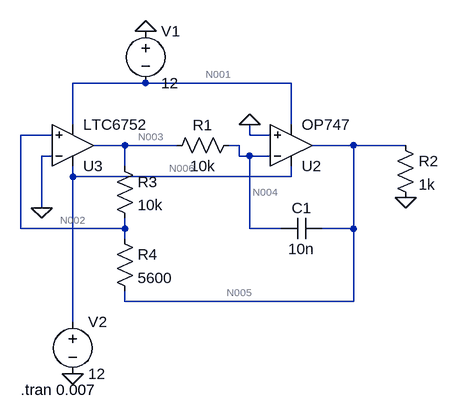
[diagram p0: schematic (labo 3) oscilador onda tirangular ej5tp4.asc]
(labo 3) oscilador onda tirangular ej5tp4.asc, the LTspice schematic file:
Version 4
SHEET 1 1412 680
WIRE 208 64 96 64
WIRE 432 64 208 64
WIRE 96 128 96 64
WIRE 432 128 432 64
WIRE 64 144 16 144
WIRE 368 144 368 128
WIRE 400 144 368 144
WIRE 176 160 128 160
WIRE 256 160 176 160
WIRE 352 160 336 160
WIRE 528 160 464 160
WIRE 608 160 528 160
WIRE 64 176 48 176
WIRE 352 176 352 160
WIRE 368 176 352 176
WIRE 400 176 368 176
WIRE 176 192 176 160
WIRE 96 208 96 192
WIRE 432 208 432 192
WIRE 432 208 96 208
WIRE 48 256 48 176
WIRE 16 288 16 144
WIRE 176 288 176 272
WIRE 176 288 16 288
WIRE 368 288 368 176
WIRE 416 288 368 288
WIRE 528 288 528 160
WIRE 528 288 480 288
WIRE 176 304 176 288
WIRE 176 400 176 384
WIRE 528 400 528 288
WIRE 528 400 176 400
WIRE 96 432 96 208
FLAG 208 -16 0
FLAG 368 128 0
FLAG 608 240 0
FLAG 96 512 0
FLAG 48 256 0
SYMBOL Opamps\\OP747 432 224 M180
SYMATTR InstName U2
SYMBOL voltage 208 -32 R0
SYMATTR InstName V1
SYMATTR Value 12
SYMBOL res 352 144 R90
WINDOW 0 0 56 VBottom 2
WINDOW 3 32 56 VTop 2
SYMATTR InstName R1
SYMATTR Value 10k
SYMBOL cap 480 272 R90
WINDOW 0 0 32 VBottom 2
WINDOW 3 32 32 VTop 2
SYMATTR InstName C1
SYMATTR Value 10n
SYMBOL res 592 144 R0
SYMATTR InstName R2
SYMATTR Value 1k
SYMBOL res 160 176 R0
SYMATTR InstName R3
SYMATTR Value 10k
SYMBOL res 160 288 R0
SYMATTR InstName R4
SYMATTR Value 5600
SYMBOL voltage 96 416 R0
SYMATTR InstName V2
SYMATTR Value 12
SYMBOL Comparators\\LTC6752 96 224 M180
SYMATTR InstName U3
TEXT 16 536 Left 2 !.tran 0.007

The netlist it stands for:
* (labo 3) oscilador onda tirangular ej5tp4.asc
XU2 0 N004 N006 N001 N005 OP747  ; pins In+ In- V+ V- OUT
V1 0 N001 12
R1 N004 N003 10k
C1 N005 N004 10n
R2 N005 0 1k
R3 N003 N002 10k
R4 N002 N005 5600
V2 N006 0 12
XU3 N002 0 N006 N001 N003 LTC6752  ; pins In+ In- V+ V- OUT
.tran 0.007
.lib LTC7.lib
.backanno
.end

* Results of the author's LTspice run, read from the files saved beside the schematic
* Operating Point, zero values left out:
*   V(n004) = 80.13 µV
*   V(n001) = -12 V
*   V(n006) = 12 V
*   V(n005) = -12.23 mV
*   V(n003) = -10.55 µV
*   V(n002) = -387.1 µV
*   I(R1) = 9.068 nA
*   I(R2) = -12.23 µA
*   I(R3) = 37.66 nA
*   I(R4) = 2.114 µA
*   I(V1) = -23.6 mA
*   I(V2) = -23.59 mA
*   Ix(u2:1) = -11.07 nA
*   Ix(u2:2) = -9.068 nA
*   Ix(u2:99) = 276.4 µA
*   Ix(u2:50) = -290.7 µA
*   Ix(u2:45) = 14.34 µA
*   Ix(u3:1) = -2.076 µA
*   Ix(u3:2) = -2.063 µA
*   Ix(u3:3) = 23.32 mA
*   Ix(u3:4) = -23.31 mA
*   Ix(u3:5) = -28.59 nA
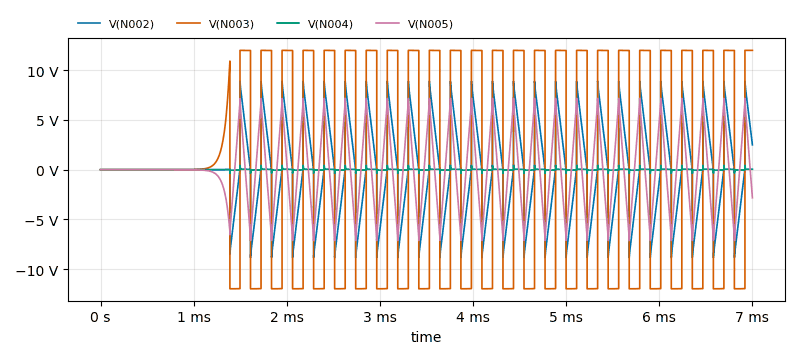
[diagram p1: Transient Analysis of (labo 3) oscilador onda tirangular ej5tp4.asc, plotted from the saved traces]
* Transient Analysis, 1 run:
*   V(N002): min -8.851 V, max 8.898 V, average -598.4 µV, rms 4.499 V, last 2.496 V
*   V(N003): min -11.98 V, max 12 V, average 42.46 mV, rms 10.76 V, last 12 V
*   V(N004): min -363.6 mV, max 437.6 mV, average 1.573 mV, rms 57.74 mV, last 35.87 mV
*   V(N005): min -7.12 V, max 7.163 V, average -36.35 mV, rms 3.545 V, last -2.831 V